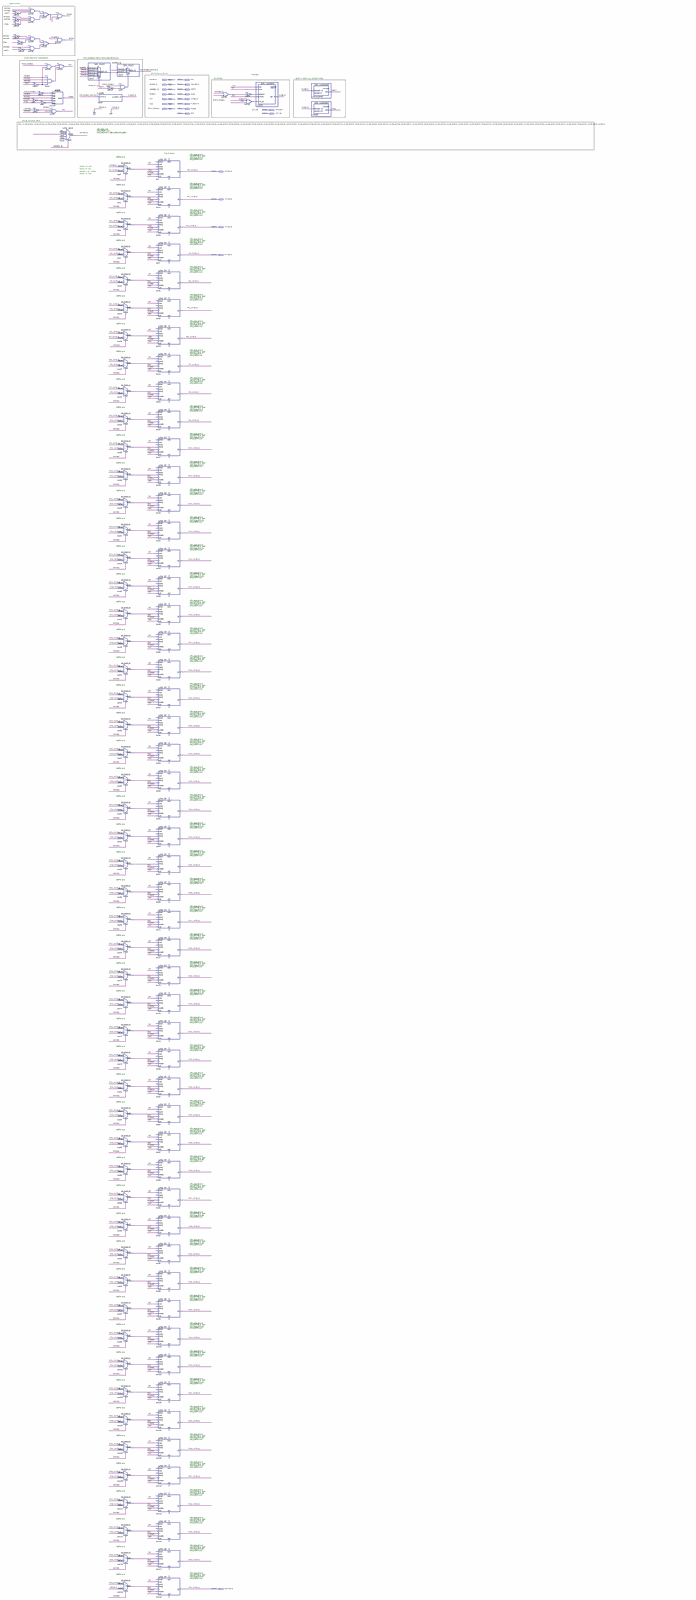
[diagram p0: schematic sheet, whole]
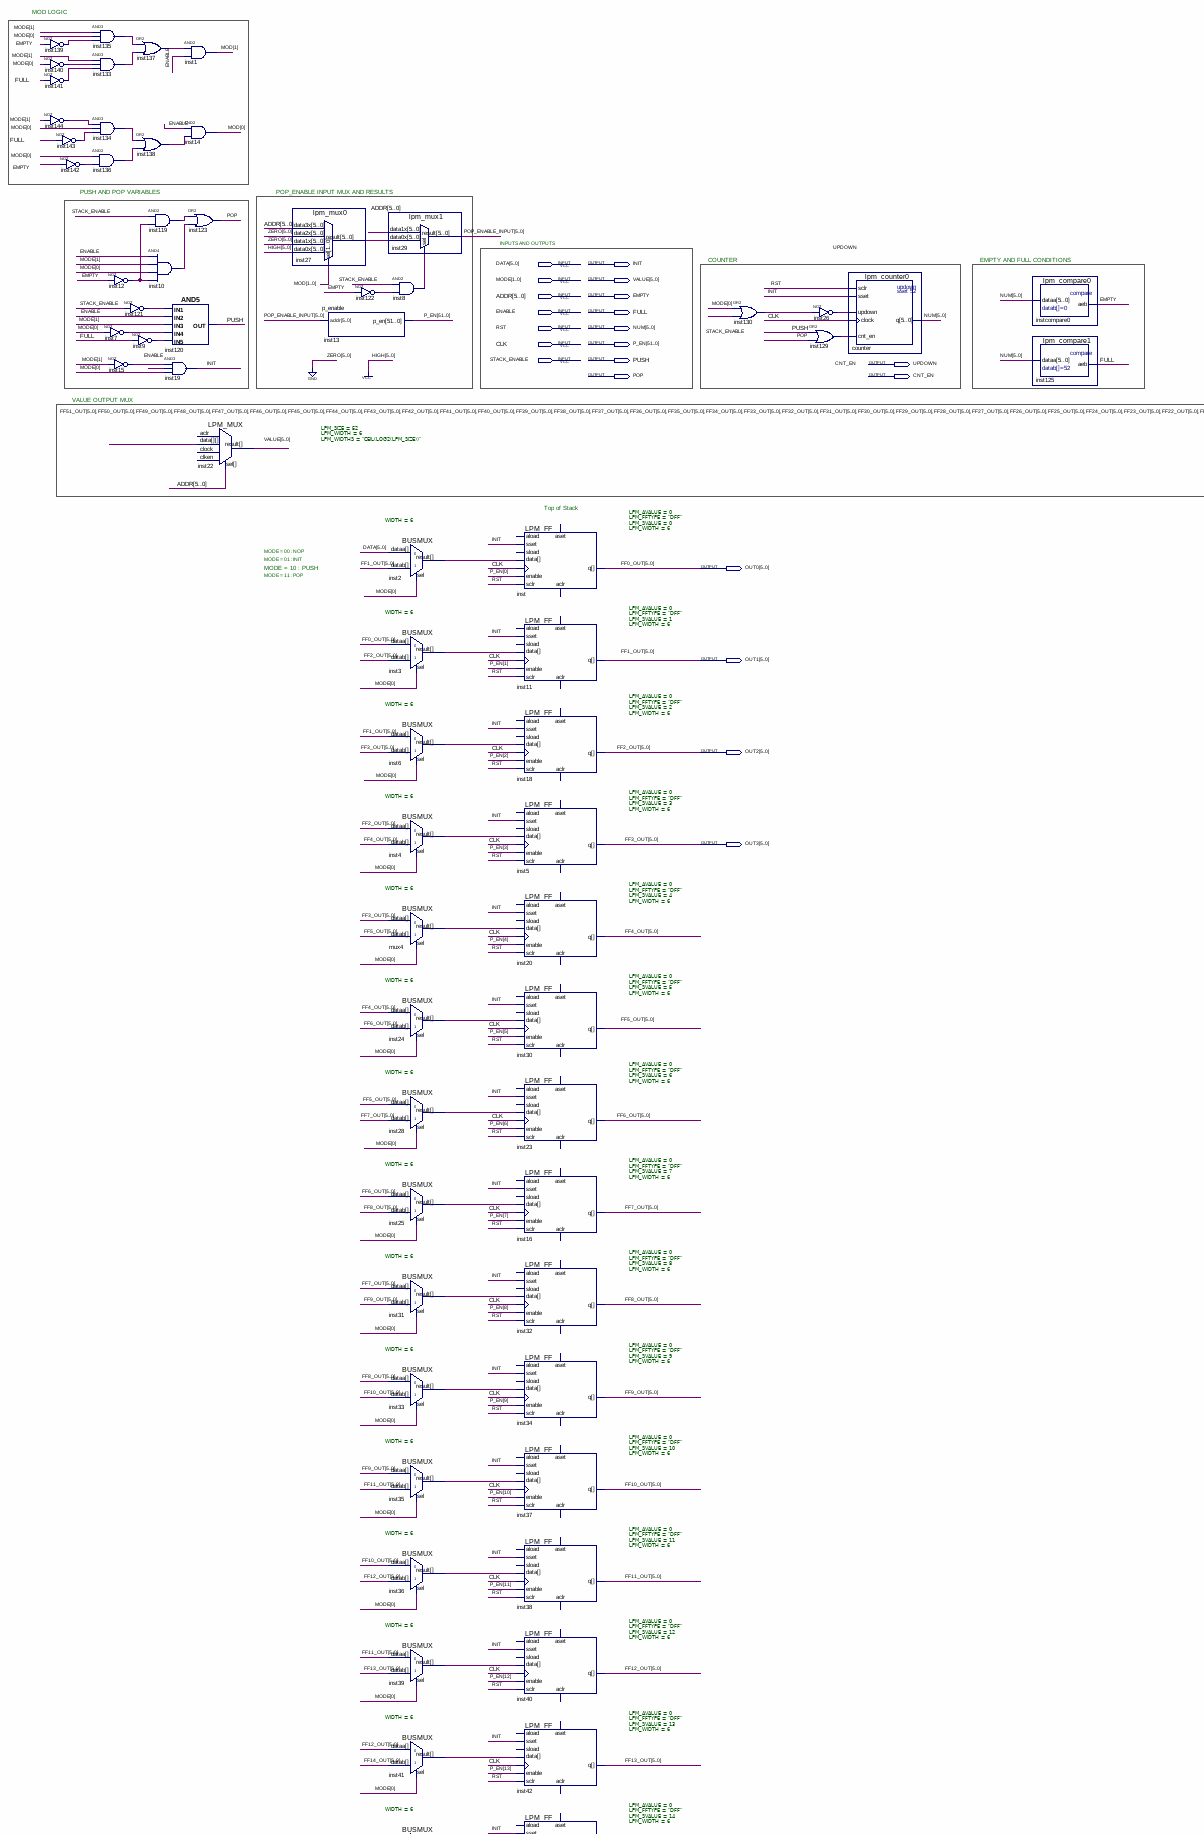
[diagram p1: schematic sheet, upper left part]
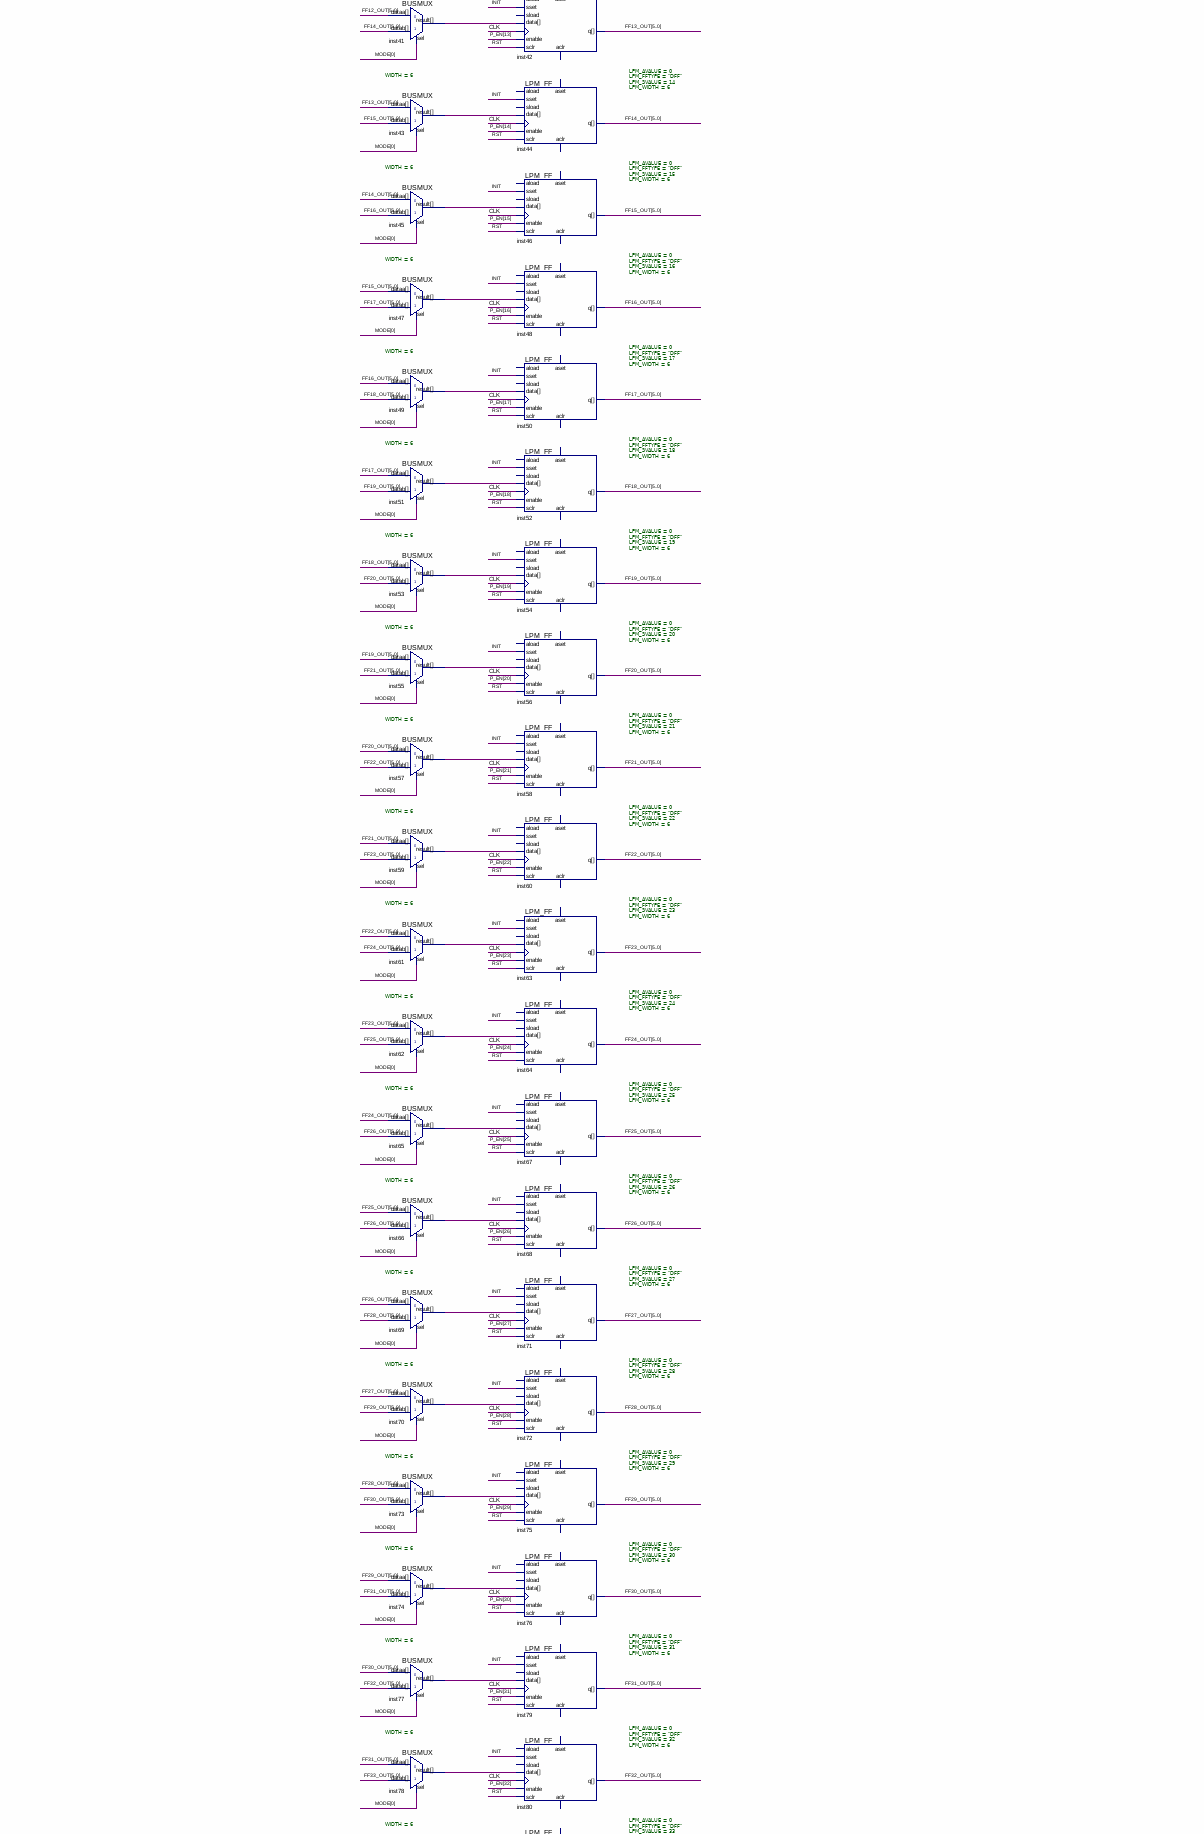
[diagram p2: schematic sheet, middle left part]
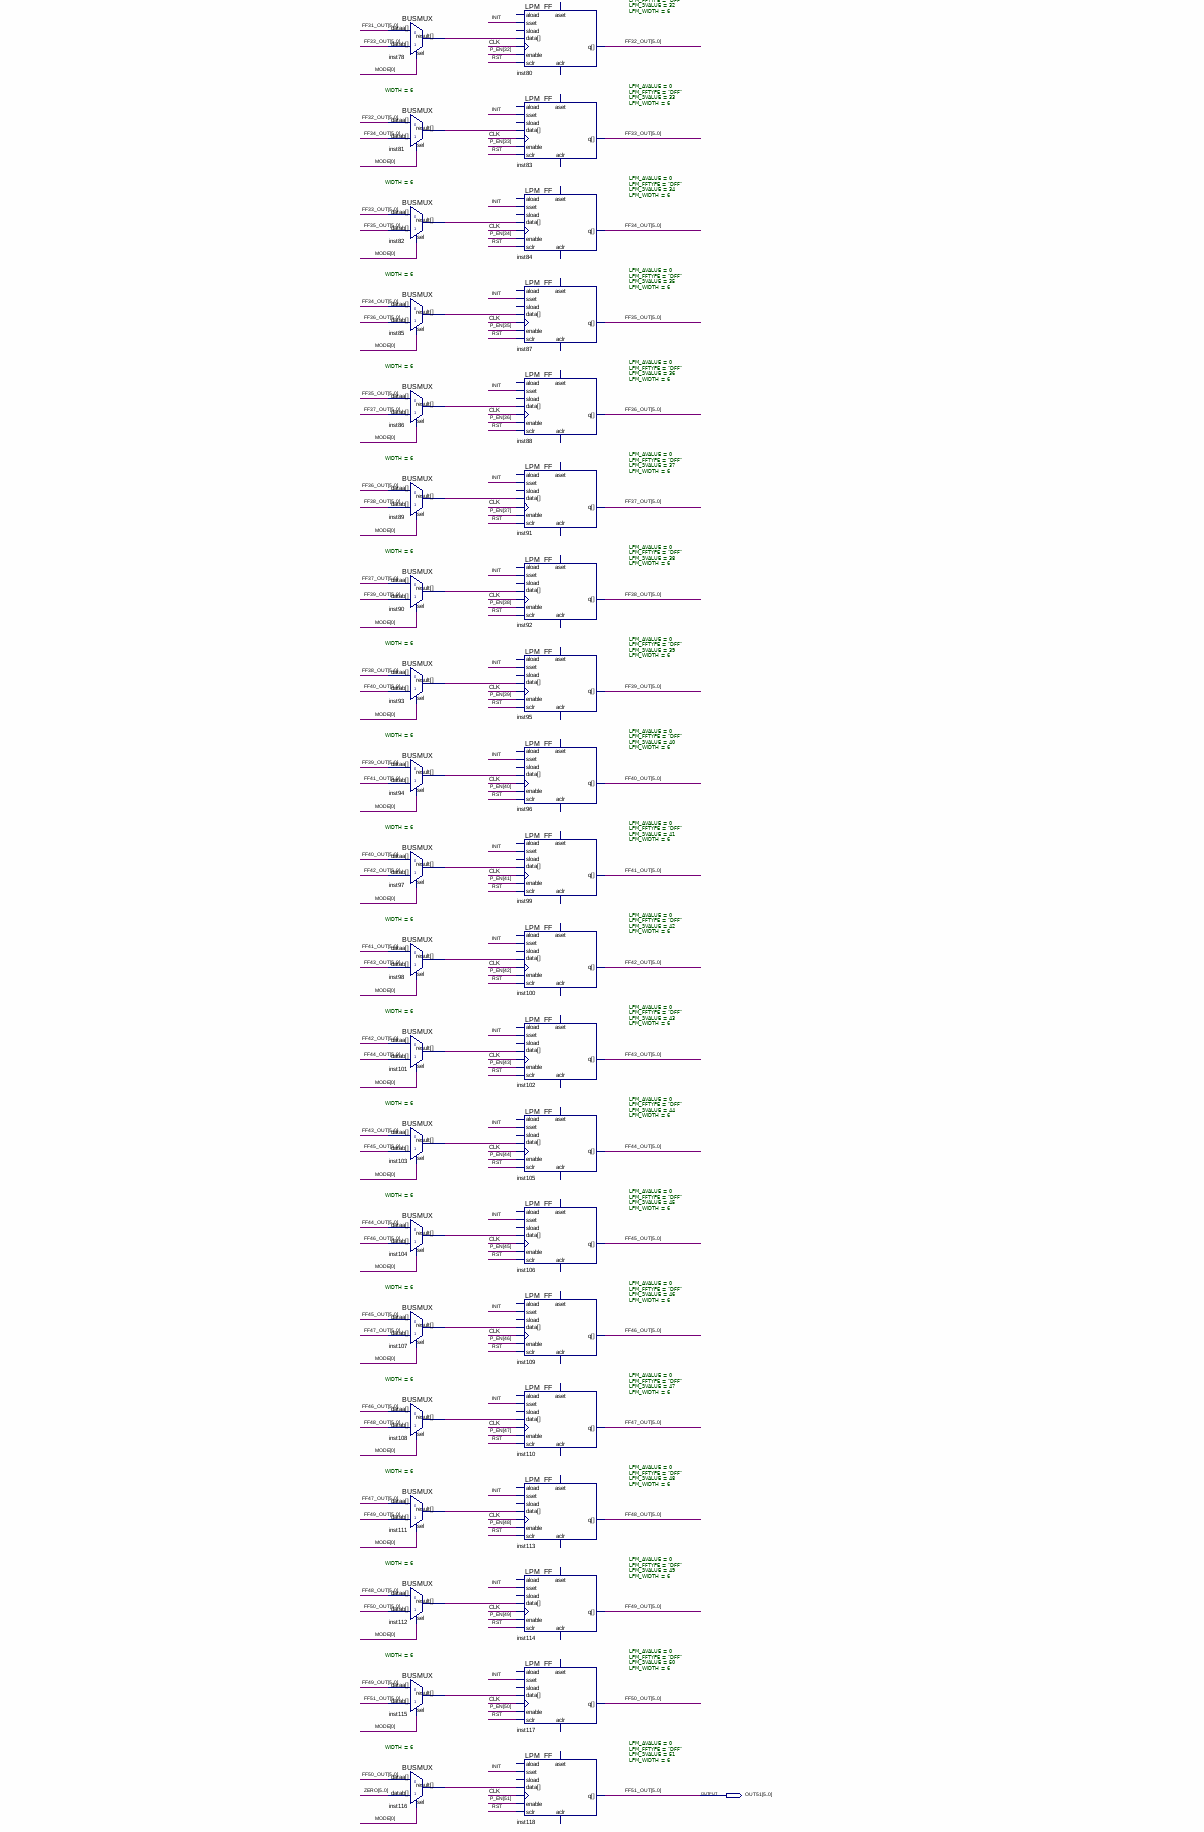
[diagram p3: schematic sheet, lower left part]
// Quartus schematic g27_stack52.bdf as structural Verilog: 140 symbols, 22 pins
module g27_stack52 (
  input  [5:0] DATA,
  input  [1:0] MODE,
  input  [5:0] ADDR,
  input  ENABLE,
  input  RST,
  input  CLK,
  input  STACK_ENABLE,
  output INIT,
  output [5:0] VALUE,
  output EMPTY,
  output FULL,
  output [5:0] NUM,
  output [51:0] P_EN,
  output PUSH,
  output UPDOWN,
  output POP,
  output CNT_EN,
  output [5:0] OUT0,
  output [5:0] OUT1,
  output [5:0] OUT2,
  output [5:0] OUT3,
  output [5:0] OUT51
);

  wire inst7_out, inst8_out, inst9_out, inst10_out, inst12_out, inst15_out, inst119_out, inst121_out,
       inst122_out, inst130_out, inst133_out, inst134_out, inst135_out, inst136_out, inst137_out,
       inst138_out, inst139_out, inst140_out, inst141_out, inst142_out, inst143_out, inst144_out;
  wire [1:0] MOD;
  wire [5:0] FF4_OUT, FF5_OUT, FF6_OUT, FF7_OUT, FF8_OUT, FF9_OUT, FF10_OUT, FF11_OUT, FF12_OUT, FF13_OUT,
       FF14_OUT, FF15_OUT, FF16_OUT, FF17_OUT, FF18_OUT, FF19_OUT, FF20_OUT, FF21_OUT, FF22_OUT, FF23_OUT,
       FF24_OUT, FF25_OUT, FF26_OUT, FF27_OUT, FF28_OUT, FF29_OUT, FF30_OUT, FF31_OUT, FF32_OUT, FF33_OUT,
       FF34_OUT, FF35_OUT, FF36_OUT, FF37_OUT, FF38_OUT, FF39_OUT, FF40_OUT, FF41_OUT, FF42_OUT, FF43_OUT,
       FF44_OUT, FF45_OUT, FF46_OUT, FF47_OUT, FF48_OUT, FF49_OUT, FF50_OUT, inst2_result, inst3_result,
       inst4_result, inst6_result, inst24_result, inst25_result, inst27_result, inst28_result, inst31_result,
       inst33_result, inst35_result, inst36_result, inst39_result, inst41_result, inst43_result,
       inst45_result, inst47_result, inst49_result, inst51_result, inst53_result, inst55_result,
       inst57_result, inst59_result, inst61_result, inst62_result, inst65_result, inst66_result,
       inst69_result, inst70_result, inst73_result, inst74_result, inst77_result, inst78_result,
       inst81_result, inst82_result, inst85_result, inst86_result, inst89_result, inst90_result,
       inst93_result, inst94_result, inst97_result, inst98_result, inst101_result, inst103_result,
       inst104_result, inst107_result, inst108_result, inst111_result, inst112_result, inst115_result,
       inst116_result, mux4_result, POP_ENABLE_INPUT;

  not inst139 (inst139_out, EMPTY);
  not inst140 (inst140_out, MODE[0]);
  not inst141 (inst141_out, FULL);
  not inst144 (inst144_out, MODE[1]);
  not inst143 (inst143_out, FULL);
  not inst142 (inst142_out, EMPTY);
  and inst135 (inst135_out, MODE[1], MODE[0], inst139_out);
  and inst133 (inst133_out, MODE[1], inst140_out, inst141_out);
  and inst134 (inst134_out, inst144_out, MODE[0], inst143_out);
  and inst136 (inst136_out, MODE[0], inst142_out);
  not inst12 (inst12_out, EMPTY);
  not inst121 (inst121_out, STACK_ENABLE);
  not inst7 (inst7_out, MODE[0]);
  not inst15 (inst15_out, MODE[1]);
  or inst137 (inst137_out, inst135_out, inst133_out);
  or inst138 (inst138_out, inst134_out, inst136_out);
  and inst119 (inst119_out, STACK_ENABLE, inst12_out);
  and inst10 (inst10_out, ENABLE, MODE[1], MODE[0], inst12_out);
  not inst9 (inst9_out, FULL);
  and inst1 (MOD[1], inst137_out, ENABLE);
  and inst14 (MOD[0], ENABLE, inst138_out);
  or inst123 (POP, inst119_out, inst10_out);
  and inst120 (PUSH, inst121_out, ENABLE, MODE[1], inst7_out, inst9_out);
  and inst19 (INIT, inst15_out, ENABLE, MODE[0]);
  LPM_MUX #(.LPM_SIZE(52), .LPM_WIDTH(6), .LPM_WIDTHS("CEIL(LOG2(LPM_SIZE))")) inst22 (
    .data({OUT51, FF50_OUT, FF49_OUT, FF48_OUT, FF47_OUT, FF46_OUT, FF45_OUT, FF44_OUT, FF43_OUT, FF42_OUT, FF41_OUT, FF40_OUT, FF39_OUT, FF38_OUT, FF37_OUT, FF36_OUT, FF35_OUT, FF34_OUT, FF33_OUT, FF32_OUT, FF31_OUT, FF30_OUT, FF29_OUT, FF28_OUT, FF27_OUT, FF26_OUT, FF25_OUT, FF24_OUT, FF23_OUT, FF22_OUT, FF21_OUT, FF20_OUT, FF19_OUT, FF18_OUT, FF17_OUT, FF16_OUT, FF15_OUT, FF14_OUT, FF13_OUT, FF12_OUT, FF11_OUT, FF10_OUT, FF9_OUT, FF8_OUT, FF7_OUT, FF6_OUT, FF5_OUT, FF4_OUT, OUT3, OUT2, OUT1, OUT0}),
    .sel(ADDR), .result(VALUE));  // open: clock, aclr, clken
  lpm_mux0 inst27 (
    .data3x(ADDR), .data2x({6{1'b0}}), .data1x({6{1'b0}}), .data0x({6{1'b1}}), .sel(MOD),
    .result(inst27_result));
  p_enable inst13 (.addr(POP_ENABLE_INPUT), .p_en(P_EN));
  not inst122 (inst122_out, EMPTY);
  lpm_mux1 inst29 (.data1x(ADDR), .data0x(inst27_result), .sel(inst8_out), .result(POP_ENABLE_INPUT));
  and inst8 (inst8_out, STACK_ENABLE, inst122_out);
  BUSMUX #(.WIDTH(6)) inst2 (.datab(OUT1), .sel(MODE[0]), .dataa(DATA), .result(inst2_result));
  BUSMUX #(.WIDTH(6)) inst3 (.datab(OUT2), .sel(MODE[0]), .dataa(OUT0), .result(inst3_result));
  BUSMUX #(.WIDTH(6)) inst6 (.datab(OUT3), .sel(MODE[0]), .dataa(OUT1), .result(inst6_result));
  BUSMUX #(.WIDTH(6)) inst4 (.datab(FF4_OUT), .sel(MODE[0]), .dataa(OUT2), .result(inst4_result));
  BUSMUX #(.WIDTH(6)) mux4 (.datab(FF5_OUT), .sel(MODE[0]), .dataa(OUT3), .result(mux4_result));
  BUSMUX #(.WIDTH(6)) inst24 (.datab(FF6_OUT), .sel(MODE[0]), .dataa(FF4_OUT), .result(inst24_result));
  BUSMUX #(.WIDTH(6)) inst28 (.datab(FF7_OUT), .sel(MODE[0]), .dataa(FF5_OUT), .result(inst28_result));
  BUSMUX #(.WIDTH(6)) inst25 (.datab(FF8_OUT), .sel(MODE[0]), .dataa(FF6_OUT), .result(inst25_result));
  BUSMUX #(.WIDTH(6)) inst31 (.datab(FF9_OUT), .sel(MODE[0]), .dataa(FF7_OUT), .result(inst31_result));
  BUSMUX #(.WIDTH(6)) inst33 (.datab(FF10_OUT), .sel(MODE[0]), .dataa(FF8_OUT), .result(inst33_result));
  BUSMUX #(.WIDTH(6)) inst35 (.datab(FF11_OUT), .sel(MODE[0]), .dataa(FF9_OUT), .result(inst35_result));
  BUSMUX #(.WIDTH(6)) inst36 (.datab(FF12_OUT), .sel(MODE[0]), .dataa(FF10_OUT), .result(inst36_result));
  BUSMUX #(.WIDTH(6)) inst39 (.datab(FF13_OUT), .sel(MODE[0]), .dataa(FF11_OUT), .result(inst39_result));
  BUSMUX #(.WIDTH(6)) inst41 (.datab(FF14_OUT), .sel(MODE[0]), .dataa(FF12_OUT), .result(inst41_result));
  BUSMUX #(.WIDTH(6)) inst43 (.datab(FF15_OUT), .sel(MODE[0]), .dataa(FF13_OUT), .result(inst43_result));
  BUSMUX #(.WIDTH(6)) inst45 (.datab(FF16_OUT), .sel(MODE[0]), .dataa(FF14_OUT), .result(inst45_result));
  BUSMUX #(.WIDTH(6)) inst47 (.datab(FF17_OUT), .sel(MODE[0]), .dataa(FF15_OUT), .result(inst47_result));
  BUSMUX #(.WIDTH(6)) inst49 (.datab(FF18_OUT), .sel(MODE[0]), .dataa(FF16_OUT), .result(inst49_result));
  BUSMUX #(.WIDTH(6)) inst51 (.datab(FF19_OUT), .sel(MODE[0]), .dataa(FF17_OUT), .result(inst51_result));
  BUSMUX #(.WIDTH(6)) inst53 (.datab(FF20_OUT), .sel(MODE[0]), .dataa(FF18_OUT), .result(inst53_result));
  BUSMUX #(.WIDTH(6)) inst55 (.datab(FF21_OUT), .sel(MODE[0]), .dataa(FF19_OUT), .result(inst55_result));
  BUSMUX #(.WIDTH(6)) inst57 (.datab(FF22_OUT), .sel(MODE[0]), .dataa(FF20_OUT), .result(inst57_result));
  BUSMUX #(.WIDTH(6)) inst59 (.datab(FF23_OUT), .sel(MODE[0]), .dataa(FF21_OUT), .result(inst59_result));
  BUSMUX #(.WIDTH(6)) inst61 (.datab(FF24_OUT), .sel(MODE[0]), .dataa(FF22_OUT), .result(inst61_result));
  BUSMUX #(.WIDTH(6)) inst62 (.datab(FF25_OUT), .sel(MODE[0]), .dataa(FF23_OUT), .result(inst62_result));
  BUSMUX #(.WIDTH(6)) inst65 (.datab(FF26_OUT), .sel(MODE[0]), .dataa(FF24_OUT), .result(inst65_result));
  BUSMUX #(.WIDTH(6)) inst66 (.datab(FF26_OUT), .sel(MODE[0]), .dataa(FF25_OUT), .result(inst66_result));
  BUSMUX #(.WIDTH(6)) inst69 (.datab(FF28_OUT), .sel(MODE[0]), .dataa(FF26_OUT), .result(inst69_result));
  BUSMUX #(.WIDTH(6)) inst70 (.datab(FF29_OUT), .sel(MODE[0]), .dataa(FF27_OUT), .result(inst70_result));
  BUSMUX #(.WIDTH(6)) inst73 (.datab(FF30_OUT), .sel(MODE[0]), .dataa(FF28_OUT), .result(inst73_result));
  BUSMUX #(.WIDTH(6)) inst74 (.datab(FF31_OUT), .sel(MODE[0]), .dataa(FF29_OUT), .result(inst74_result));
  BUSMUX #(.WIDTH(6)) inst77 (.datab(FF32_OUT), .sel(MODE[0]), .dataa(FF30_OUT), .result(inst77_result));
  BUSMUX #(.WIDTH(6)) inst78 (.datab(FF33_OUT), .sel(MODE[0]), .dataa(FF31_OUT), .result(inst78_result));
  BUSMUX #(.WIDTH(6)) inst81 (.datab(FF34_OUT), .sel(MODE[0]), .dataa(FF32_OUT), .result(inst81_result));
  BUSMUX #(.WIDTH(6)) inst82 (.datab(FF35_OUT), .sel(MODE[0]), .dataa(FF33_OUT), .result(inst82_result));
  BUSMUX #(.WIDTH(6)) inst85 (.datab(FF36_OUT), .sel(MODE[0]), .dataa(FF34_OUT), .result(inst85_result));
  BUSMUX #(.WIDTH(6)) inst86 (.datab(FF37_OUT), .sel(MODE[0]), .dataa(FF35_OUT), .result(inst86_result));
  BUSMUX #(.WIDTH(6)) inst89 (.datab(FF38_OUT), .sel(MODE[0]), .dataa(FF36_OUT), .result(inst89_result));
  BUSMUX #(.WIDTH(6)) inst90 (.datab(FF39_OUT), .sel(MODE[0]), .dataa(FF37_OUT), .result(inst90_result));
  BUSMUX #(.WIDTH(6)) inst93 (.datab(FF40_OUT), .sel(MODE[0]), .dataa(FF38_OUT), .result(inst93_result));
  BUSMUX #(.WIDTH(6)) inst94 (.datab(FF41_OUT), .sel(MODE[0]), .dataa(FF39_OUT), .result(inst94_result));
  BUSMUX #(.WIDTH(6)) inst97 (.datab(FF42_OUT), .sel(MODE[0]), .dataa(FF40_OUT), .result(inst97_result));
  BUSMUX #(.WIDTH(6)) inst98 (.datab(FF43_OUT), .sel(MODE[0]), .dataa(FF41_OUT), .result(inst98_result));
  BUSMUX #(.WIDTH(6)) inst101 (.datab(FF44_OUT), .sel(MODE[0]), .dataa(FF42_OUT), .result(inst101_result));
  BUSMUX #(.WIDTH(6)) inst103 (.datab(FF45_OUT), .sel(MODE[0]), .dataa(FF43_OUT), .result(inst103_result));
  BUSMUX #(.WIDTH(6)) inst104 (.datab(FF46_OUT), .sel(MODE[0]), .dataa(FF44_OUT), .result(inst104_result));
  BUSMUX #(.WIDTH(6)) inst107 (.datab(FF47_OUT), .sel(MODE[0]), .dataa(FF45_OUT), .result(inst107_result));
  BUSMUX #(.WIDTH(6)) inst108 (.datab(FF48_OUT), .sel(MODE[0]), .dataa(FF46_OUT), .result(inst108_result));
  BUSMUX #(.WIDTH(6)) inst111 (.datab(FF49_OUT), .sel(MODE[0]), .dataa(FF47_OUT), .result(inst111_result));
  BUSMUX #(.WIDTH(6)) inst112 (.datab(FF50_OUT), .sel(MODE[0]), .dataa(FF48_OUT), .result(inst112_result));
  BUSMUX #(.WIDTH(6)) inst115 (.datab(OUT51), .sel(MODE[0]), .dataa(FF49_OUT), .result(inst115_result));
  BUSMUX #(.WIDTH(6)) inst116 (.datab({6{1'b0}}), .sel(MODE[0]), .dataa(FF50_OUT), .result(inst116_result));
  LPM_FF #(.LPM_AVALUE(0), .LPM_FFTYPE("DFF"), .LPM_SVALUE(0), .LPM_WIDTH(6)) inst (
    .enable(P_EN[0]), .clock(CLK), .sset(INIT), .sclr(RST), .data(inst2_result), .q(OUT0));  // open: aload, sload, aset, aclr
  LPM_FF #(.LPM_AVALUE(0), .LPM_FFTYPE("DFF"), .LPM_SVALUE(1), .LPM_WIDTH(6)) inst11 (
    .enable(P_EN[1]), .clock(CLK), .sset(INIT), .sclr(RST), .data(inst3_result), .q(OUT1));  // open: aload, sload, aset, aclr
  LPM_FF #(.LPM_AVALUE(0), .LPM_FFTYPE("DFF"), .LPM_SVALUE(2), .LPM_WIDTH(6)) inst18 (
    .enable(P_EN[2]), .clock(CLK), .sset(INIT), .sclr(RST), .data(inst6_result), .q(OUT2));  // open: aload, sload, aset, aclr
  LPM_FF #(.LPM_AVALUE(0), .LPM_FFTYPE("DFF"), .LPM_SVALUE(3), .LPM_WIDTH(6)) inst5 (
    .enable(P_EN[3]), .clock(CLK), .sset(INIT), .sclr(RST), .data(inst4_result), .q(OUT3));  // open: aload, sload, aset, aclr
  LPM_FF #(.LPM_AVALUE(0), .LPM_FFTYPE("DFF"), .LPM_SVALUE(4), .LPM_WIDTH(6)) inst20 (
    .enable(P_EN[4]), .clock(CLK), .sset(INIT), .sclr(RST), .data(mux4_result), .q(FF4_OUT));  // open: aload, sload, aset, aclr
  LPM_FF #(.LPM_AVALUE(0), .LPM_FFTYPE("DFF"), .LPM_SVALUE(5), .LPM_WIDTH(6)) inst30 (
    .enable(P_EN[5]), .clock(CLK), .sset(INIT), .sclr(RST), .data(inst24_result), .q(FF5_OUT));  // open: aload, sload, aset, aclr
  LPM_FF #(.LPM_AVALUE(0), .LPM_FFTYPE("DFF"), .LPM_SVALUE(6), .LPM_WIDTH(6)) inst23 (
    .enable(P_EN[6]), .clock(CLK), .sset(INIT), .sclr(RST), .data(inst28_result), .q(FF6_OUT));  // open: aload, sload, aset, aclr
  LPM_FF #(.LPM_AVALUE(0), .LPM_FFTYPE("DFF"), .LPM_SVALUE(7), .LPM_WIDTH(6)) inst16 (
    .enable(P_EN[7]), .clock(CLK), .sset(INIT), .sclr(RST), .data(inst25_result), .q(FF7_OUT));  // open: aload, sload, aset, aclr
  LPM_FF #(.LPM_AVALUE(0), .LPM_FFTYPE("DFF"), .LPM_SVALUE(8), .LPM_WIDTH(6)) inst32 (
    .enable(P_EN[8]), .clock(CLK), .sset(INIT), .sclr(RST), .data(inst31_result), .q(FF8_OUT));  // open: aload, sload, aset, aclr
  LPM_FF #(.LPM_AVALUE(0), .LPM_FFTYPE("DFF"), .LPM_SVALUE(9), .LPM_WIDTH(6)) inst34 (
    .enable(P_EN[9]), .clock(CLK), .sset(INIT), .sclr(RST), .data(inst33_result), .q(FF9_OUT));  // open: aload, sload, aset, aclr
  LPM_FF #(.LPM_AVALUE(0), .LPM_FFTYPE("DFF"), .LPM_SVALUE(10), .LPM_WIDTH(6)) inst37 (
    .enable(P_EN[10]), .clock(CLK), .sset(INIT), .sclr(RST), .data(inst35_result), .q(FF10_OUT));  // open: aload, sload, aset, aclr
  LPM_FF #(.LPM_AVALUE(0), .LPM_FFTYPE("DFF"), .LPM_SVALUE(11), .LPM_WIDTH(6)) inst38 (
    .enable(P_EN[11]), .clock(CLK), .sset(INIT), .sclr(RST), .data(inst36_result), .q(FF11_OUT));  // open: aload, sload, aset, aclr
  LPM_FF #(.LPM_AVALUE(0), .LPM_FFTYPE("DFF"), .LPM_SVALUE(12), .LPM_WIDTH(6)) inst40 (
    .enable(P_EN[12]), .clock(CLK), .sset(INIT), .sclr(RST), .data(inst39_result), .q(FF12_OUT));  // open: aload, sload, aset, aclr
  LPM_FF #(.LPM_AVALUE(0), .LPM_FFTYPE("DFF"), .LPM_SVALUE(13), .LPM_WIDTH(6)) inst42 (
    .enable(P_EN[13]), .clock(CLK), .sset(INIT), .sclr(RST), .data(inst41_result), .q(FF13_OUT));  // open: aload, sload, aset, aclr
  LPM_FF #(.LPM_AVALUE(0), .LPM_FFTYPE("DFF"), .LPM_SVALUE(14), .LPM_WIDTH(6)) inst44 (
    .enable(P_EN[14]), .clock(CLK), .sset(INIT), .sclr(RST), .data(inst43_result), .q(FF14_OUT));  // open: aload, sload, aset, aclr
  LPM_FF #(.LPM_AVALUE(0), .LPM_FFTYPE("DFF"), .LPM_SVALUE(15), .LPM_WIDTH(6)) inst46 (
    .enable(P_EN[15]), .clock(CLK), .sset(INIT), .sclr(RST), .data(inst45_result), .q(FF15_OUT));  // open: aload, sload, aset, aclr
  LPM_FF #(.LPM_AVALUE(0), .LPM_FFTYPE("DFF"), .LPM_SVALUE(16), .LPM_WIDTH(6)) inst48 (
    .enable(P_EN[16]), .clock(CLK), .sset(INIT), .sclr(RST), .data(inst47_result), .q(FF16_OUT));  // open: aload, sload, aset, aclr
  LPM_FF #(.LPM_AVALUE(0), .LPM_FFTYPE("DFF"), .LPM_SVALUE(17), .LPM_WIDTH(6)) inst50 (
    .enable(P_EN[17]), .clock(CLK), .sset(INIT), .sclr(RST), .data(inst49_result), .q(FF17_OUT));  // open: aload, sload, aset, aclr
  LPM_FF #(.LPM_AVALUE(0), .LPM_FFTYPE("DFF"), .LPM_SVALUE(18), .LPM_WIDTH(6)) inst52 (
    .enable(P_EN[18]), .clock(CLK), .sset(INIT), .sclr(RST), .data(inst51_result), .q(FF18_OUT));  // open: aload, sload, aset, aclr
  LPM_FF #(.LPM_AVALUE(0), .LPM_FFTYPE("DFF"), .LPM_SVALUE(19), .LPM_WIDTH(6)) inst54 (
    .enable(P_EN[19]), .clock(CLK), .sset(INIT), .sclr(RST), .data(inst53_result), .q(FF19_OUT));  // open: aload, sload, aset, aclr
  LPM_FF #(.LPM_AVALUE(0), .LPM_FFTYPE("DFF"), .LPM_SVALUE(20), .LPM_WIDTH(6)) inst56 (
    .enable(P_EN[20]), .clock(CLK), .sset(INIT), .sclr(RST), .data(inst55_result), .q(FF20_OUT));  // open: aload, sload, aset, aclr
  LPM_FF #(.LPM_AVALUE(0), .LPM_FFTYPE("DFF"), .LPM_SVALUE(21), .LPM_WIDTH(6)) inst58 (
    .enable(P_EN[21]), .clock(CLK), .sset(INIT), .sclr(RST), .data(inst57_result), .q(FF21_OUT));  // open: aload, sload, aset, aclr
  LPM_FF #(.LPM_AVALUE(0), .LPM_FFTYPE("DFF"), .LPM_SVALUE(22), .LPM_WIDTH(6)) inst60 (
    .enable(P_EN[22]), .clock(CLK), .sset(INIT), .sclr(RST), .data(inst59_result), .q(FF22_OUT));  // open: aload, sload, aset, aclr
  LPM_FF #(.LPM_AVALUE(0), .LPM_FFTYPE("DFF"), .LPM_SVALUE(23), .LPM_WIDTH(6)) inst63 (
    .enable(P_EN[23]), .clock(CLK), .sset(INIT), .sclr(RST), .data(inst61_result), .q(FF23_OUT));  // open: aload, sload, aset, aclr
  LPM_FF #(.LPM_AVALUE(0), .LPM_FFTYPE("DFF"), .LPM_SVALUE(24), .LPM_WIDTH(6)) inst64 (
    .enable(P_EN[24]), .clock(CLK), .sset(INIT), .sclr(RST), .data(inst62_result), .q(FF24_OUT));  // open: aload, sload, aset, aclr
  LPM_FF #(.LPM_AVALUE(0), .LPM_FFTYPE("DFF"), .LPM_SVALUE(25), .LPM_WIDTH(6)) inst67 (
    .enable(P_EN[25]), .clock(CLK), .sset(INIT), .sclr(RST), .data(inst65_result), .q(FF25_OUT));  // open: aload, sload, aset, aclr
  LPM_FF #(.LPM_AVALUE(0), .LPM_FFTYPE("DFF"), .LPM_SVALUE(26), .LPM_WIDTH(6)) inst68 (
    .enable(P_EN[26]), .clock(CLK), .sset(INIT), .sclr(RST), .data(inst66_result), .q(FF26_OUT));  // open: aload, sload, aset, aclr
  LPM_FF #(.LPM_AVALUE(0), .LPM_FFTYPE("DFF"), .LPM_SVALUE(27), .LPM_WIDTH(6)) inst71 (
    .enable(P_EN[27]), .clock(CLK), .sset(INIT), .sclr(RST), .data(inst69_result), .q(FF27_OUT));  // open: aload, sload, aset, aclr
  LPM_FF #(.LPM_AVALUE(0), .LPM_FFTYPE("DFF"), .LPM_SVALUE(28), .LPM_WIDTH(6)) inst72 (
    .enable(P_EN[28]), .clock(CLK), .sset(INIT), .sclr(RST), .data(inst70_result), .q(FF28_OUT));  // open: aload, sload, aset, aclr
  LPM_FF #(.LPM_AVALUE(0), .LPM_FFTYPE("DFF"), .LPM_SVALUE(29), .LPM_WIDTH(6)) inst75 (
    .enable(P_EN[29]), .clock(CLK), .sset(INIT), .sclr(RST), .data(inst73_result), .q(FF29_OUT));  // open: aload, sload, aset, aclr
  LPM_FF #(.LPM_AVALUE(0), .LPM_FFTYPE("DFF"), .LPM_SVALUE(30), .LPM_WIDTH(6)) inst76 (
    .enable(P_EN[30]), .clock(CLK), .sset(INIT), .sclr(RST), .data(inst74_result), .q(FF30_OUT));  // open: aload, sload, aset, aclr
  LPM_FF #(.LPM_AVALUE(0), .LPM_FFTYPE("DFF"), .LPM_SVALUE(31), .LPM_WIDTH(6)) inst79 (
    .enable(P_EN[31]), .clock(CLK), .sset(INIT), .sclr(RST), .data(inst77_result), .q(FF31_OUT));  // open: aload, sload, aset, aclr
  LPM_FF #(.LPM_AVALUE(0), .LPM_FFTYPE("DFF"), .LPM_SVALUE(32), .LPM_WIDTH(6)) inst80 (
    .enable(P_EN[32]), .clock(CLK), .sset(INIT), .sclr(RST), .data(inst78_result), .q(FF32_OUT));  // open: aload, sload, aset, aclr
  LPM_FF #(.LPM_AVALUE(0), .LPM_FFTYPE("DFF"), .LPM_SVALUE(33), .LPM_WIDTH(6)) inst83 (
    .enable(P_EN[33]), .clock(CLK), .sset(INIT), .sclr(RST), .data(inst81_result), .q(FF33_OUT));  // open: aload, sload, aset, aclr
  LPM_FF #(.LPM_AVALUE(0), .LPM_FFTYPE("DFF"), .LPM_SVALUE(34), .LPM_WIDTH(6)) inst84 (
    .enable(P_EN[34]), .clock(CLK), .sset(INIT), .sclr(RST), .data(inst82_result), .q(FF34_OUT));  // open: aload, sload, aset, aclr
  LPM_FF #(.LPM_AVALUE(0), .LPM_FFTYPE("DFF"), .LPM_SVALUE(35), .LPM_WIDTH(6)) inst87 (
    .enable(P_EN[35]), .clock(CLK), .sset(INIT), .sclr(RST), .data(inst85_result), .q(FF35_OUT));  // open: aload, sload, aset, aclr
  LPM_FF #(.LPM_AVALUE(0), .LPM_FFTYPE("DFF"), .LPM_SVALUE(36), .LPM_WIDTH(6)) inst88 (
    .enable(P_EN[36]), .clock(CLK), .sset(INIT), .sclr(RST), .data(inst86_result), .q(FF36_OUT));  // open: aload, sload, aset, aclr
  LPM_FF #(.LPM_AVALUE(0), .LPM_FFTYPE("DFF"), .LPM_SVALUE(37), .LPM_WIDTH(6)) inst91 (
    .enable(P_EN[37]), .clock(CLK), .sset(INIT), .sclr(RST), .data(inst89_result), .q(FF37_OUT));  // open: aload, sload, aset, aclr
  LPM_FF #(.LPM_AVALUE(0), .LPM_FFTYPE("DFF"), .LPM_SVALUE(38), .LPM_WIDTH(6)) inst92 (
    .enable(P_EN[38]), .clock(CLK), .sset(INIT), .sclr(RST), .data(inst90_result), .q(FF38_OUT));  // open: aload, sload, aset, aclr
  LPM_FF #(.LPM_AVALUE(0), .LPM_FFTYPE("DFF"), .LPM_SVALUE(39), .LPM_WIDTH(6)) inst95 (
    .enable(P_EN[39]), .clock(CLK), .sset(INIT), .sclr(RST), .data(inst93_result), .q(FF39_OUT));  // open: aload, sload, aset, aclr
  LPM_FF #(.LPM_AVALUE(0), .LPM_FFTYPE("DFF"), .LPM_SVALUE(40), .LPM_WIDTH(6)) inst96 (
    .enable(P_EN[40]), .clock(CLK), .sset(INIT), .sclr(RST), .data(inst94_result), .q(FF40_OUT));  // open: aload, sload, aset, aclr
  LPM_FF #(.LPM_AVALUE(0), .LPM_FFTYPE("DFF"), .LPM_SVALUE(41), .LPM_WIDTH(6)) inst99 (
    .enable(P_EN[41]), .clock(CLK), .sset(INIT), .sclr(RST), .data(inst97_result), .q(FF41_OUT));  // open: aload, sload, aset, aclr
  LPM_FF #(.LPM_AVALUE(0), .LPM_FFTYPE("DFF"), .LPM_SVALUE(42), .LPM_WIDTH(6)) inst100 (
    .enable(P_EN[42]), .clock(CLK), .sset(INIT), .sclr(RST), .data(inst98_result), .q(FF42_OUT));  // open: aload, sload, aset, aclr
  LPM_FF #(.LPM_AVALUE(0), .LPM_FFTYPE("DFF"), .LPM_SVALUE(43), .LPM_WIDTH(6)) inst102 (
    .enable(P_EN[43]), .clock(CLK), .sset(INIT), .sclr(RST), .data(inst101_result), .q(FF43_OUT));  // open: aload, sload, aset, aclr
  LPM_FF #(.LPM_AVALUE(0), .LPM_FFTYPE("DFF"), .LPM_SVALUE(44), .LPM_WIDTH(6)) inst105 (
    .enable(P_EN[44]), .clock(CLK), .sset(INIT), .sclr(RST), .data(inst103_result), .q(FF44_OUT));  // open: aload, sload, aset, aclr
  LPM_FF #(.LPM_AVALUE(0), .LPM_FFTYPE("DFF"), .LPM_SVALUE(45), .LPM_WIDTH(6)) inst106 (
    .enable(P_EN[45]), .clock(CLK), .sset(INIT), .sclr(RST), .data(inst104_result), .q(FF45_OUT));  // open: aload, sload, aset, aclr
  LPM_FF #(.LPM_AVALUE(0), .LPM_FFTYPE("DFF"), .LPM_SVALUE(46), .LPM_WIDTH(6)) inst109 (
    .enable(P_EN[46]), .clock(CLK), .sset(INIT), .sclr(RST), .data(inst107_result), .q(FF46_OUT));  // open: aload, sload, aset, aclr
  LPM_FF #(.LPM_AVALUE(0), .LPM_FFTYPE("DFF"), .LPM_SVALUE(47), .LPM_WIDTH(6)) inst110 (
    .enable(P_EN[47]), .clock(CLK), .sset(INIT), .sclr(RST), .data(inst108_result), .q(FF47_OUT));  // open: aload, sload, aset, aclr
  LPM_FF #(.LPM_AVALUE(0), .LPM_FFTYPE("DFF"), .LPM_SVALUE(48), .LPM_WIDTH(6)) inst113 (
    .enable(P_EN[48]), .clock(CLK), .sset(INIT), .sclr(RST), .data(inst111_result), .q(FF48_OUT));  // open: aload, sload, aset, aclr
  LPM_FF #(.LPM_AVALUE(0), .LPM_FFTYPE("DFF"), .LPM_SVALUE(49), .LPM_WIDTH(6)) inst114 (
    .enable(P_EN[49]), .clock(CLK), .sset(INIT), .sclr(RST), .data(inst112_result), .q(FF49_OUT));  // open: aload, sload, aset, aclr
  LPM_FF #(.LPM_AVALUE(0), .LPM_FFTYPE("DFF"), .LPM_SVALUE(50), .LPM_WIDTH(6)) inst117 (
    .enable(P_EN[50]), .clock(CLK), .sset(INIT), .sclr(RST), .data(inst115_result), .q(FF50_OUT));  // open: aload, sload, aset, aclr
  LPM_FF #(.LPM_AVALUE(0), .LPM_FFTYPE("DFF"), .LPM_SVALUE(51), .LPM_WIDTH(6)) inst118 (
    .enable(P_EN[51]), .clock(CLK), .sset(INIT), .sclr(RST), .data(inst116_result), .q(OUT51));  // open: aload, sload, aset, aclr
  or inst130 (inst130_out, MODE[0], STACK_ENABLE);
  not inst26 (UPDOWN, inst130_out);
  or inst129 (CNT_EN, PUSH, POP);
  lpm_counter0 counter (.sclr(RST), .sset(INIT), .updown(UPDOWN), .clock(CLK), .cnt_en(CNT_EN), .q(NUM));
  lpm_compare0 instcompare0 (.dataa(NUM), .aeb(EMPTY));
  lpm_compare1 inst125 (.dataa(NUM), .aeb(FULL));

  // Other names for the same wires on the sheet: FF0_OUT[5:0] = OUT0; FF1_OUT[5:0] = OUT1; FF2_OUT[5:0] = OUT2;
  //   FF3_OUT[5:0] = OUT3; FF51_OUT[5:0] = OUT51

  // Notes on the sheet:
  //   MOD LOGIC
  //   PUSH AND POP VARIABLES
  //   POP_ENABLE INPUT MUX AND RESULTS
  //   INPUTS AND OUTPUTS
  //   COUNTER
  //   EMPTY AND FULL CONDITIONS
  //   VALUE OUTPUT MUX
  //   Top of Stack
  //   MODE = 00 : NOP
  //   MODE = 01 : INIT
  //   MODE = 10 : PUSH
  //   MODE = 11 : POP
endmodule
